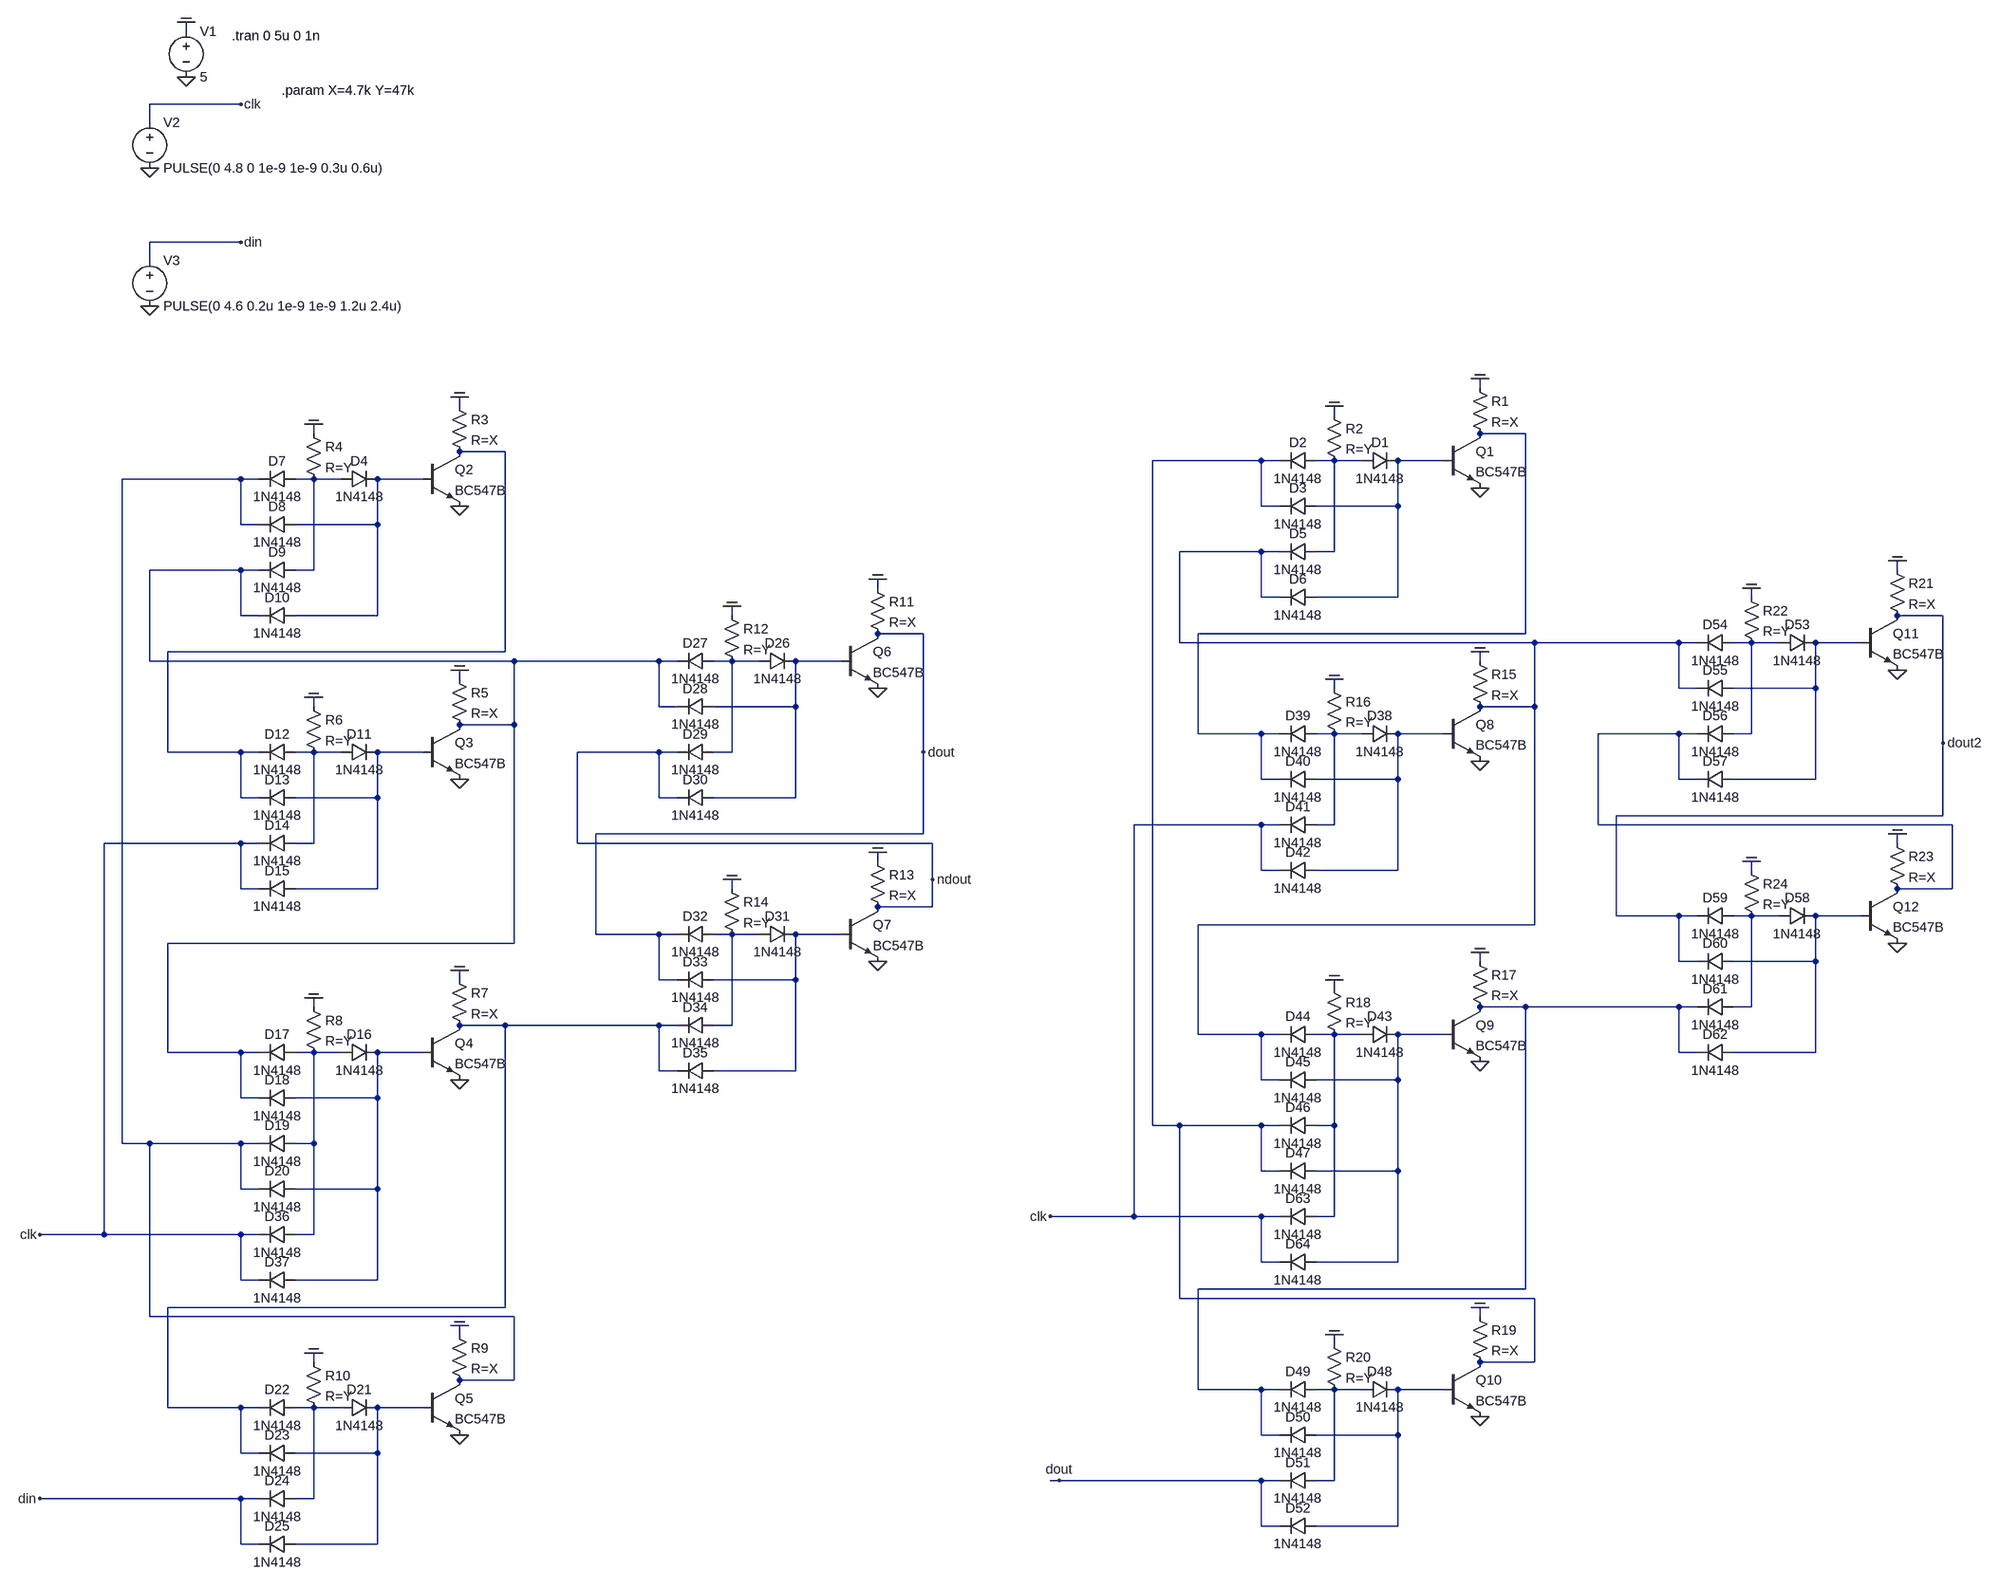
[diagram p0: schematic dtl_shiftreg.asc]
dtl_shiftreg.asc, the LTspice schematic file:
Version 4
SHEET 1 4000 3056
WIRE -16 -144 -16 -160
WIRE 80 -16 -80 -16
WIRE -80 16 -80 -16
WIRE 80 240 -80 240
WIRE -80 272 -80 240
WIRE 2816 976 2816 960
WIRE 464 1008 464 992
WIRE 2560 1024 2560 1008
WIRE 208 1056 208 1040
WIRE 2896 1056 2816 1056
WIRE 544 1088 464 1088
WIRE 2432 1104 2224 1104
WIRE 2464 1104 2432 1104
WIRE 2560 1104 2528 1104
WIRE 2608 1104 2560 1104
WIRE 2752 1104 2672 1104
WIRE 80 1136 -128 1136
WIRE 112 1136 80 1136
WIRE 208 1136 176 1136
WIRE 256 1136 208 1136
WIRE 400 1136 320 1136
WIRE 2432 1184 2432 1104
WIRE 2464 1184 2432 1184
WIRE 2672 1184 2672 1104
WIRE 2672 1184 2528 1184
WIRE 80 1216 80 1136
WIRE 112 1216 80 1216
WIRE 320 1216 320 1136
WIRE 320 1216 176 1216
WIRE 2432 1264 2272 1264
WIRE 2464 1264 2432 1264
WIRE 2560 1264 2560 1104
WIRE 2560 1264 2528 1264
WIRE 80 1296 -80 1296
WIRE 112 1296 80 1296
WIRE 208 1296 208 1136
WIRE 208 1296 176 1296
WIRE 3872 1296 3872 1280
WIRE 1520 1328 1520 1312
WIRE 2432 1344 2432 1264
WIRE 2464 1344 2432 1344
WIRE 2672 1344 2672 1184
WIRE 2672 1344 2528 1344
WIRE 3616 1344 3616 1328
WIRE 80 1376 80 1296
WIRE 112 1376 80 1376
WIRE 320 1376 320 1216
WIRE 320 1376 176 1376
WIRE 1264 1376 1264 1360
WIRE 3952 1376 3872 1376
WIRE 1600 1408 1520 1408
WIRE 2896 1408 2896 1056
WIRE 2896 1408 2304 1408
WIRE 2272 1424 2272 1264
WIRE 2912 1424 2272 1424
WIRE 3488 1424 2912 1424
WIRE 3520 1424 3488 1424
WIRE 3616 1424 3584 1424
WIRE 3664 1424 3616 1424
WIRE 3808 1424 3728 1424
WIRE 544 1440 544 1088
WIRE 544 1440 -48 1440
WIRE -80 1456 -80 1296
WIRE 560 1456 -80 1456
WIRE 1136 1456 560 1456
WIRE 1168 1456 1136 1456
WIRE 1264 1456 1232 1456
WIRE 1312 1456 1264 1456
WIRE 1456 1456 1376 1456
WIRE 2816 1456 2816 1440
WIRE 464 1488 464 1472
WIRE 2560 1504 2560 1488
WIRE 3488 1504 3488 1424
WIRE 3520 1504 3488 1504
WIRE 3728 1504 3728 1424
WIRE 3728 1504 3584 1504
WIRE 208 1536 208 1520
WIRE 1136 1536 1136 1456
WIRE 1168 1536 1136 1536
WIRE 1376 1536 1376 1456
WIRE 1376 1536 1232 1536
WIRE 2912 1536 2912 1424
WIRE 2912 1536 2816 1536
WIRE 560 1568 560 1456
WIRE 560 1568 464 1568
WIRE 2304 1584 2304 1408
WIRE 2432 1584 2304 1584
WIRE 2464 1584 2432 1584
WIRE 2560 1584 2528 1584
WIRE 2608 1584 2560 1584
WIRE 2752 1584 2672 1584
WIRE 3488 1584 3328 1584
WIRE 3520 1584 3488 1584
WIRE 3616 1584 3616 1424
WIRE 3616 1584 3584 1584
WIRE 3952 1600 3952 1376
WIRE -48 1616 -48 1440
WIRE 80 1616 -48 1616
WIRE 112 1616 80 1616
WIRE 208 1616 176 1616
WIRE 256 1616 208 1616
WIRE 400 1616 320 1616
WIRE 1136 1616 976 1616
WIRE 1168 1616 1136 1616
WIRE 1264 1616 1264 1456
WIRE 1264 1616 1232 1616
WIRE 1600 1616 1600 1408
WIRE 2432 1664 2432 1584
WIRE 2464 1664 2432 1664
WIRE 2672 1664 2672 1584
WIRE 2672 1664 2528 1664
WIRE 3488 1664 3488 1584
WIRE 3520 1664 3488 1664
WIRE 3728 1664 3728 1504
WIRE 3728 1664 3584 1664
WIRE 80 1696 80 1616
WIRE 112 1696 80 1696
WIRE 320 1696 320 1616
WIRE 320 1696 176 1696
WIRE 1136 1696 1136 1616
WIRE 1168 1696 1136 1696
WIRE 1376 1696 1376 1536
WIRE 1376 1696 1232 1696
WIRE 3952 1728 3952 1600
WIRE 3952 1728 3360 1728
WIRE 2432 1744 2192 1744
WIRE 2464 1744 2432 1744
WIRE 2560 1744 2560 1584
WIRE 2560 1744 2528 1744
WIRE 3328 1744 3328 1584
WIRE 3968 1744 3328 1744
WIRE 1600 1760 1600 1616
WIRE 1600 1760 1008 1760
WIRE 80 1776 -160 1776
WIRE 112 1776 80 1776
WIRE 208 1776 208 1616
WIRE 208 1776 176 1776
WIRE 976 1776 976 1616
WIRE 1616 1776 976 1776
WIRE 3872 1776 3872 1760
WIRE 1520 1808 1520 1792
WIRE 2432 1824 2432 1744
WIRE 2464 1824 2432 1824
WIRE 2672 1824 2672 1664
WIRE 2672 1824 2528 1824
WIRE 3616 1824 3616 1808
WIRE 1616 1840 1616 1776
WIRE 80 1856 80 1776
WIRE 112 1856 80 1856
WIRE 320 1856 320 1696
WIRE 320 1856 176 1856
WIRE 1264 1856 1264 1840
WIRE 3968 1856 3968 1744
WIRE 3968 1856 3872 1856
WIRE 1616 1888 1616 1840
WIRE 1616 1888 1520 1888
WIRE 3360 1904 3360 1728
WIRE 3488 1904 3360 1904
WIRE 3520 1904 3488 1904
WIRE 3616 1904 3584 1904
WIRE 3664 1904 3616 1904
WIRE 3808 1904 3728 1904
WIRE 2912 1920 2912 1536
WIRE 2912 1920 2304 1920
WIRE 1008 1936 1008 1760
WIRE 1136 1936 1008 1936
WIRE 1168 1936 1136 1936
WIRE 1264 1936 1232 1936
WIRE 1312 1936 1264 1936
WIRE 1456 1936 1376 1936
WIRE 560 1952 560 1568
WIRE 560 1952 -48 1952
WIRE 2816 1984 2816 1968
WIRE 3488 1984 3488 1904
WIRE 3520 1984 3488 1984
WIRE 3728 1984 3728 1904
WIRE 3728 1984 3584 1984
WIRE 464 2016 464 2000
WIRE 1136 2016 1136 1936
WIRE 1168 2016 1136 2016
WIRE 1376 2016 1376 1936
WIRE 1376 2016 1232 2016
WIRE 2560 2032 2560 2016
WIRE 208 2064 208 2048
WIRE 2896 2064 2816 2064
WIRE 3488 2064 2896 2064
WIRE 3520 2064 3488 2064
WIRE 3616 2064 3616 1904
WIRE 3616 2064 3584 2064
WIRE 544 2096 464 2096
WIRE 1136 2096 544 2096
WIRE 1168 2096 1136 2096
WIRE 1264 2096 1264 1936
WIRE 1264 2096 1232 2096
WIRE 2304 2112 2304 1920
WIRE 2432 2112 2304 2112
WIRE 2464 2112 2432 2112
WIRE 2560 2112 2528 2112
WIRE 2608 2112 2560 2112
WIRE 2752 2112 2672 2112
WIRE -48 2144 -48 1952
WIRE 80 2144 -48 2144
WIRE 112 2144 80 2144
WIRE 208 2144 176 2144
WIRE 256 2144 208 2144
WIRE 400 2144 320 2144
WIRE 3488 2144 3488 2064
WIRE 3520 2144 3488 2144
WIRE 3728 2144 3728 1984
WIRE 3728 2144 3584 2144
WIRE 1136 2176 1136 2096
WIRE 1168 2176 1136 2176
WIRE 1376 2176 1376 2016
WIRE 1376 2176 1232 2176
WIRE 2432 2192 2432 2112
WIRE 2464 2192 2432 2192
WIRE 2672 2192 2672 2112
WIRE 2672 2192 2528 2192
WIRE 80 2224 80 2144
WIRE 112 2224 80 2224
WIRE 320 2224 320 2144
WIRE 320 2224 176 2224
WIRE 2224 2272 2224 1104
WIRE 2272 2272 2224 2272
WIRE 2432 2272 2272 2272
WIRE 2464 2272 2432 2272
WIRE 2560 2272 2560 2112
WIRE 2560 2272 2528 2272
WIRE -128 2304 -128 1136
WIRE -80 2304 -128 2304
WIRE 80 2304 -80 2304
WIRE 112 2304 80 2304
WIRE 208 2304 208 2144
WIRE 208 2304 176 2304
WIRE 2432 2352 2432 2272
WIRE 2464 2352 2432 2352
WIRE 2672 2352 2672 2192
WIRE 2672 2352 2528 2352
WIRE 80 2384 80 2304
WIRE 112 2384 80 2384
WIRE 320 2384 320 2224
WIRE 320 2384 176 2384
WIRE 2192 2432 2192 1744
WIRE 2192 2432 2016 2432
WIRE 2432 2432 2192 2432
WIRE 2464 2432 2432 2432
WIRE 2560 2432 2560 2272
WIRE 2560 2432 2528 2432
WIRE -160 2464 -160 1776
WIRE -160 2464 -336 2464
WIRE 80 2464 -160 2464
WIRE 112 2464 80 2464
WIRE 208 2464 208 2304
WIRE 208 2464 176 2464
WIRE 2432 2512 2432 2432
WIRE 2464 2512 2432 2512
WIRE 2672 2512 2672 2352
WIRE 2672 2512 2528 2512
WIRE 80 2544 80 2464
WIRE 112 2544 80 2544
WIRE 320 2544 320 2384
WIRE 320 2544 176 2544
WIRE 2896 2560 2896 2064
WIRE 2896 2560 2304 2560
WIRE 2272 2576 2272 2272
WIRE 2912 2576 2272 2576
WIRE 544 2592 544 2096
WIRE 544 2592 -48 2592
WIRE -80 2608 -80 2304
WIRE 560 2608 -80 2608
WIRE 2816 2608 2816 2592
WIRE 464 2640 464 2624
WIRE 2560 2656 2560 2640
WIRE 208 2688 208 2672
WIRE 2912 2688 2912 2576
WIRE 2912 2688 2816 2688
WIRE 560 2720 560 2608
WIRE 560 2720 464 2720
WIRE 2304 2736 2304 2560
WIRE 2432 2736 2304 2736
WIRE 2464 2736 2432 2736
WIRE 2560 2736 2528 2736
WIRE 2608 2736 2560 2736
WIRE 2752 2736 2672 2736
WIRE -48 2768 -48 2592
WIRE 80 2768 -48 2768
WIRE 112 2768 80 2768
WIRE 208 2768 176 2768
WIRE 256 2768 208 2768
WIRE 400 2768 320 2768
WIRE 2432 2816 2432 2736
WIRE 2464 2816 2432 2816
WIRE 2672 2816 2672 2736
WIRE 2672 2816 2528 2816
WIRE 80 2848 80 2768
WIRE 112 2848 80 2848
WIRE 320 2848 320 2768
WIRE 320 2848 176 2848
WIRE 2032 2896 2016 2896
WIRE 2432 2896 2032 2896
WIRE 2464 2896 2432 2896
WIRE 2560 2896 2560 2736
WIRE 2560 2896 2528 2896
WIRE 80 2928 -336 2928
WIRE 112 2928 80 2928
WIRE 208 2928 208 2768
WIRE 208 2928 176 2928
WIRE 2432 2976 2432 2896
WIRE 2464 2976 2432 2976
WIRE 2672 2976 2672 2816
WIRE 2672 2976 2528 2976
WIRE 80 3008 80 2928
WIRE 112 3008 80 3008
WIRE 320 3008 320 2848
WIRE 320 3008 176 3008
FLAG -16 -64 0
FLAG -16 -160 COM
FLAG -80 96 0
FLAG 464 1184 0
FLAG 464 992 COM
FLAG 208 1040 COM
FLAG 464 1664 0
FLAG 464 1472 COM
FLAG 208 1520 COM
FLAG 464 2192 0
FLAG 464 2000 COM
FLAG 208 2048 COM
FLAG 464 2816 0
FLAG 464 2624 COM
FLAG 208 2672 COM
FLAG 1520 1504 0
FLAG 1520 1312 COM
FLAG 1264 1360 COM
FLAG 1520 1984 0
FLAG 1520 1792 COM
FLAG 1264 1840 COM
FLAG -336 2464 clk
FLAG -336 2928 din
FLAG 1600 1616 dout
FLAG 80 -16 clk
FLAG -80 352 0
FLAG 80 240 din
FLAG 1616 1840 ndout
FLAG 2816 1152 0
FLAG 2816 960 COM
FLAG 2560 1008 COM
FLAG 2816 1632 0
FLAG 2816 1440 COM
FLAG 2560 1488 COM
FLAG 2816 2160 0
FLAG 2816 1968 COM
FLAG 2560 2016 COM
FLAG 2816 2784 0
FLAG 2816 2592 COM
FLAG 2560 2640 COM
FLAG 3872 1472 0
FLAG 3872 1280 COM
FLAG 3616 1328 COM
FLAG 3872 1952 0
FLAG 3872 1760 COM
FLAG 3616 1808 COM
FLAG 2016 2432 clk
FLAG 2032 2896 dout
FLAG 3952 1600 dout2
SYMBOL voltage -16 -160 R0
WINDOW 123 0 0 Left 2
WINDOW 39 0 0 Left 2
SYMATTR InstName V1
SYMATTR Value 5
SYMBOL voltage -80 0 R0
WINDOW 123 0 0 Left 2
WINDOW 39 0 0 Left 2
SYMATTR InstName V2
SYMATTR Value PULSE(0 4.8 0 1e-9 1e-9 0.3u 0.6u)
SYMBOL diode 256 1152 R270
WINDOW 0 32 32 VTop 2
WINDOW 3 0 32 VBottom 2
SYMATTR InstName D4
SYMATTR Value 1N4148
SYMBOL npn 400 1088 R0
SYMATTR InstName Q2
SYMATTR Value BC547B
SYMBOL res 448 992 R0
SYMATTR InstName R3
SYMATTR Value R=X
SYMBOL diode 176 1120 R90
WINDOW 0 0 32 VBottom 2
WINDOW 3 32 32 VTop 2
SYMATTR InstName D7
SYMATTR Value 1N4148
SYMBOL res 192 1040 R0
SYMATTR InstName R4
SYMATTR Value R=Y
SYMBOL diode 176 1200 R90
WINDOW 0 0 32 VBottom 2
WINDOW 3 32 32 VTop 2
SYMATTR InstName D8
SYMATTR Value 1N4148
SYMBOL diode 176 1280 R90
WINDOW 0 0 32 VBottom 2
WINDOW 3 32 32 VTop 2
SYMATTR InstName D9
SYMATTR Value 1N4148
SYMBOL diode 176 1360 R90
WINDOW 0 0 32 VBottom 2
WINDOW 3 32 32 VTop 2
SYMATTR InstName D10
SYMATTR Value 1N4148
SYMBOL diode 256 1632 R270
WINDOW 0 32 32 VTop 2
WINDOW 3 0 32 VBottom 2
SYMATTR InstName D11
SYMATTR Value 1N4148
SYMBOL npn 400 1568 R0
SYMATTR InstName Q3
SYMATTR Value BC547B
SYMBOL res 448 1472 R0
SYMATTR InstName R5
SYMATTR Value R=X
SYMBOL diode 176 1600 R90
WINDOW 0 0 32 VBottom 2
WINDOW 3 32 32 VTop 2
SYMATTR InstName D12
SYMATTR Value 1N4148
SYMBOL res 192 1520 R0
SYMATTR InstName R6
SYMATTR Value R=Y
SYMBOL diode 176 1680 R90
WINDOW 0 0 32 VBottom 2
WINDOW 3 32 32 VTop 2
SYMATTR InstName D13
SYMATTR Value 1N4148
SYMBOL diode 176 1760 R90
WINDOW 0 0 32 VBottom 2
WINDOW 3 32 32 VTop 2
SYMATTR InstName D14
SYMATTR Value 1N4148
SYMBOL diode 176 1840 R90
WINDOW 0 0 32 VBottom 2
WINDOW 3 32 32 VTop 2
SYMATTR InstName D15
SYMATTR Value 1N4148
SYMBOL diode 256 2160 R270
WINDOW 0 32 32 VTop 2
WINDOW 3 0 32 VBottom 2
SYMATTR InstName D16
SYMATTR Value 1N4148
SYMBOL npn 400 2096 R0
SYMATTR InstName Q4
SYMATTR Value BC547B
SYMBOL res 448 2000 R0
SYMATTR InstName R7
SYMATTR Value R=X
SYMBOL diode 176 2128 R90
WINDOW 0 0 32 VBottom 2
WINDOW 3 32 32 VTop 2
SYMATTR InstName D17
SYMATTR Value 1N4148
SYMBOL res 192 2048 R0
SYMATTR InstName R8
SYMATTR Value R=Y
SYMBOL diode 176 2208 R90
WINDOW 0 0 32 VBottom 2
WINDOW 3 32 32 VTop 2
SYMATTR InstName D18
SYMATTR Value 1N4148
SYMBOL diode 176 2288 R90
WINDOW 0 0 32 VBottom 2
WINDOW 3 32 32 VTop 2
SYMATTR InstName D19
SYMATTR Value 1N4148
SYMBOL diode 176 2368 R90
WINDOW 0 0 32 VBottom 2
WINDOW 3 32 32 VTop 2
SYMATTR InstName D20
SYMATTR Value 1N4148
SYMBOL diode 256 2784 R270
WINDOW 0 32 32 VTop 2
WINDOW 3 0 32 VBottom 2
SYMATTR InstName D21
SYMATTR Value 1N4148
SYMBOL npn 400 2720 R0
SYMATTR InstName Q5
SYMATTR Value BC547B
SYMBOL res 448 2624 R0
SYMATTR InstName R9
SYMATTR Value R=X
SYMBOL diode 176 2752 R90
WINDOW 0 0 32 VBottom 2
WINDOW 3 32 32 VTop 2
SYMATTR InstName D22
SYMATTR Value 1N4148
SYMBOL res 192 2672 R0
SYMATTR InstName R10
SYMATTR Value R=Y
SYMBOL diode 176 2832 R90
WINDOW 0 0 32 VBottom 2
WINDOW 3 32 32 VTop 2
SYMATTR InstName D23
SYMATTR Value 1N4148
SYMBOL diode 176 2912 R90
WINDOW 0 0 32 VBottom 2
WINDOW 3 32 32 VTop 2
SYMATTR InstName D24
SYMATTR Value 1N4148
SYMBOL diode 176 2992 R90
WINDOW 0 0 32 VBottom 2
WINDOW 3 32 32 VTop 2
SYMATTR InstName D25
SYMATTR Value 1N4148
SYMBOL diode 1312 1472 R270
WINDOW 0 32 32 VTop 2
WINDOW 3 0 32 VBottom 2
SYMATTR InstName D26
SYMATTR Value 1N4148
SYMBOL npn 1456 1408 R0
SYMATTR InstName Q6
SYMATTR Value BC547B
SYMBOL res 1504 1312 R0
SYMATTR InstName R11
SYMATTR Value R=X
SYMBOL diode 1232 1440 R90
WINDOW 0 0 32 VBottom 2
WINDOW 3 32 32 VTop 2
SYMATTR InstName D27
SYMATTR Value 1N4148
SYMBOL res 1248 1360 R0
SYMATTR InstName R12
SYMATTR Value R=Y
SYMBOL diode 1232 1520 R90
WINDOW 0 0 32 VBottom 2
WINDOW 3 32 32 VTop 2
SYMATTR InstName D28
SYMATTR Value 1N4148
SYMBOL diode 1232 1600 R90
WINDOW 0 0 32 VBottom 2
WINDOW 3 32 32 VTop 2
SYMATTR InstName D29
SYMATTR Value 1N4148
SYMBOL diode 1232 1680 R90
WINDOW 0 0 32 VBottom 2
WINDOW 3 32 32 VTop 2
SYMATTR InstName D30
SYMATTR Value 1N4148
SYMBOL diode 1312 1952 R270
WINDOW 0 32 32 VTop 2
WINDOW 3 0 32 VBottom 2
SYMATTR InstName D31
SYMATTR Value 1N4148
SYMBOL npn 1456 1888 R0
SYMATTR InstName Q7
SYMATTR Value BC547B
SYMBOL res 1504 1792 R0
SYMATTR InstName R13
SYMATTR Value R=X
SYMBOL diode 1232 1920 R90
WINDOW 0 0 32 VBottom 2
WINDOW 3 32 32 VTop 2
SYMATTR InstName D32
SYMATTR Value 1N4148
SYMBOL res 1248 1840 R0
SYMATTR InstName R14
SYMATTR Value R=Y
SYMBOL diode 1232 2000 R90
WINDOW 0 0 32 VBottom 2
WINDOW 3 32 32 VTop 2
SYMATTR InstName D33
SYMATTR Value 1N4148
SYMBOL diode 1232 2080 R90
WINDOW 0 0 32 VBottom 2
WINDOW 3 32 32 VTop 2
SYMATTR InstName D34
SYMATTR Value 1N4148
SYMBOL diode 1232 2160 R90
WINDOW 0 0 32 VBottom 2
WINDOW 3 32 32 VTop 2
SYMATTR InstName D35
SYMATTR Value 1N4148
SYMBOL diode 176 2448 R90
WINDOW 0 0 32 VBottom 2
WINDOW 3 32 32 VTop 2
SYMATTR InstName D36
SYMATTR Value 1N4148
SYMBOL diode 176 2528 R90
WINDOW 0 0 32 VBottom 2
WINDOW 3 32 32 VTop 2
SYMATTR InstName D37
SYMATTR Value 1N4148
SYMBOL voltage -80 256 R0
WINDOW 123 0 0 Left 2
WINDOW 39 0 0 Left 2
SYMATTR InstName V3
SYMATTR Value PULSE(0 4.6 0.2u 1e-9 1e-9 1.2u 2.4u)
SYMBOL diode 2608 1120 R270
WINDOW 0 32 32 VTop 2
WINDOW 3 0 32 VBottom 2
SYMATTR InstName D1
SYMATTR Value 1N4148
SYMBOL npn 2752 1056 R0
SYMATTR InstName Q1
SYMATTR Value BC547B
SYMBOL res 2800 960 R0
SYMATTR InstName R1
SYMATTR Value R=X
SYMBOL diode 2528 1088 R90
WINDOW 0 0 32 VBottom 2
WINDOW 3 32 32 VTop 2
SYMATTR InstName D2
SYMATTR Value 1N4148
SYMBOL res 2544 1008 R0
SYMATTR InstName R2
SYMATTR Value R=Y
SYMBOL diode 2528 1168 R90
WINDOW 0 0 32 VBottom 2
WINDOW 3 32 32 VTop 2
SYMATTR InstName D3
SYMATTR Value 1N4148
SYMBOL diode 2528 1248 R90
WINDOW 0 0 32 VBottom 2
WINDOW 3 32 32 VTop 2
SYMATTR InstName D5
SYMATTR Value 1N4148
SYMBOL diode 2528 1328 R90
WINDOW 0 0 32 VBottom 2
WINDOW 3 32 32 VTop 2
SYMATTR InstName D6
SYMATTR Value 1N4148
SYMBOL diode 2608 1600 R270
WINDOW 0 32 32 VTop 2
WINDOW 3 0 32 VBottom 2
SYMATTR InstName D38
SYMATTR Value 1N4148
SYMBOL npn 2752 1536 R0
SYMATTR InstName Q8
SYMATTR Value BC547B
SYMBOL res 2800 1440 R0
SYMATTR InstName R15
SYMATTR Value R=X
SYMBOL diode 2528 1568 R90
WINDOW 0 0 32 VBottom 2
WINDOW 3 32 32 VTop 2
SYMATTR InstName D39
SYMATTR Value 1N4148
SYMBOL res 2544 1488 R0
SYMATTR InstName R16
SYMATTR Value R=Y
SYMBOL diode 2528 1648 R90
WINDOW 0 0 32 VBottom 2
WINDOW 3 32 32 VTop 2
SYMATTR InstName D40
SYMATTR Value 1N4148
SYMBOL diode 2528 1728 R90
WINDOW 0 0 32 VBottom 2
WINDOW 3 32 32 VTop 2
SYMATTR InstName D41
SYMATTR Value 1N4148
SYMBOL diode 2528 1808 R90
WINDOW 0 0 32 VBottom 2
WINDOW 3 32 32 VTop 2
SYMATTR InstName D42
SYMATTR Value 1N4148
SYMBOL diode 2608 2128 R270
WINDOW 0 32 32 VTop 2
WINDOW 3 0 32 VBottom 2
SYMATTR InstName D43
SYMATTR Value 1N4148
SYMBOL npn 2752 2064 R0
SYMATTR InstName Q9
SYMATTR Value BC547B
SYMBOL res 2800 1968 R0
SYMATTR InstName R17
SYMATTR Value R=X
SYMBOL diode 2528 2096 R90
WINDOW 0 0 32 VBottom 2
WINDOW 3 32 32 VTop 2
SYMATTR InstName D44
SYMATTR Value 1N4148
SYMBOL res 2544 2016 R0
SYMATTR InstName R18
SYMATTR Value R=Y
SYMBOL diode 2528 2176 R90
WINDOW 0 0 32 VBottom 2
WINDOW 3 32 32 VTop 2
SYMATTR InstName D45
SYMATTR Value 1N4148
SYMBOL diode 2528 2256 R90
WINDOW 0 0 32 VBottom 2
WINDOW 3 32 32 VTop 2
SYMATTR InstName D46
SYMATTR Value 1N4148
SYMBOL diode 2528 2336 R90
WINDOW 0 0 32 VBottom 2
WINDOW 3 32 32 VTop 2
SYMATTR InstName D47
SYMATTR Value 1N4148
SYMBOL diode 2608 2752 R270
WINDOW 0 32 32 VTop 2
WINDOW 3 0 32 VBottom 2
SYMATTR InstName D48
SYMATTR Value 1N4148
SYMBOL npn 2752 2688 R0
SYMATTR InstName Q10
SYMATTR Value BC547B
SYMBOL res 2800 2592 R0
SYMATTR InstName R19
SYMATTR Value R=X
SYMBOL diode 2528 2720 R90
WINDOW 0 0 32 VBottom 2
WINDOW 3 32 32 VTop 2
SYMATTR InstName D49
SYMATTR Value 1N4148
SYMBOL res 2544 2640 R0
SYMATTR InstName R20
SYMATTR Value R=Y
SYMBOL diode 2528 2800 R90
WINDOW 0 0 32 VBottom 2
WINDOW 3 32 32 VTop 2
SYMATTR InstName D50
SYMATTR Value 1N4148
SYMBOL diode 2528 2880 R90
WINDOW 0 0 32 VBottom 2
WINDOW 3 32 32 VTop 2
SYMATTR InstName D51
SYMATTR Value 1N4148
SYMBOL diode 2528 2960 R90
WINDOW 0 0 32 VBottom 2
WINDOW 3 32 32 VTop 2
SYMATTR InstName D52
SYMATTR Value 1N4148
SYMBOL diode 3664 1440 R270
WINDOW 0 32 32 VTop 2
WINDOW 3 0 32 VBottom 2
SYMATTR InstName D53
SYMATTR Value 1N4148
SYMBOL npn 3808 1376 R0
SYMATTR InstName Q11
SYMATTR Value BC547B
SYMBOL res 3856 1280 R0
SYMATTR InstName R21
SYMATTR Value R=X
SYMBOL diode 3584 1408 R90
WINDOW 0 0 32 VBottom 2
WINDOW 3 32 32 VTop 2
SYMATTR InstName D54
SYMATTR Value 1N4148
SYMBOL res 3600 1328 R0
SYMATTR InstName R22
SYMATTR Value R=Y
SYMBOL diode 3584 1488 R90
WINDOW 0 0 32 VBottom 2
WINDOW 3 32 32 VTop 2
SYMATTR InstName D55
SYMATTR Value 1N4148
SYMBOL diode 3584 1568 R90
WINDOW 0 0 32 VBottom 2
WINDOW 3 32 32 VTop 2
SYMATTR InstName D56
SYMATTR Value 1N4148
SYMBOL diode 3584 1648 R90
WINDOW 0 0 32 VBottom 2
WINDOW 3 32 32 VTop 2
SYMATTR InstName D57
SYMATTR Value 1N4148
SYMBOL diode 3664 1920 R270
WINDOW 0 32 32 VTop 2
WINDOW 3 0 32 VBottom 2
SYMATTR InstName D58
SYMATTR Value 1N4148
SYMBOL npn 3808 1856 R0
SYMATTR InstName Q12
SYMATTR Value BC547B
SYMBOL res 3856 1760 R0
SYMATTR InstName R23
SYMATTR Value R=X
SYMBOL diode 3584 1888 R90
WINDOW 0 0 32 VBottom 2
WINDOW 3 32 32 VTop 2
SYMATTR InstName D59
SYMATTR Value 1N4148
SYMBOL res 3600 1808 R0
SYMATTR InstName R24
SYMATTR Value R=Y
SYMBOL diode 3584 1968 R90
WINDOW 0 0 32 VBottom 2
WINDOW 3 32 32 VTop 2
SYMATTR InstName D60
SYMATTR Value 1N4148
SYMBOL diode 3584 2048 R90
WINDOW 0 0 32 VBottom 2
WINDOW 3 32 32 VTop 2
SYMATTR InstName D61
SYMATTR Value 1N4148
SYMBOL diode 3584 2128 R90
WINDOW 0 0 32 VBottom 2
WINDOW 3 32 32 VTop 2
SYMATTR InstName D62
SYMATTR Value 1N4148
SYMBOL diode 2528 2416 R90
WINDOW 0 0 32 VBottom 2
WINDOW 3 32 32 VTop 2
SYMATTR InstName D63
SYMATTR Value 1N4148
SYMBOL diode 2528 2496 R90
WINDOW 0 0 32 VBottom 2
WINDOW 3 32 32 VTop 2
SYMATTR InstName D64
SYMATTR Value 1N4148
TEXT 64 -136 Left 2 !.tran 0 5u 0 1n
TEXT 152 -40 Left 2 !.param X=4.7k Y=47k

The netlist it stands for:
* dtl_shiftreg.asc
V1 COM 0 5
V2 clk 0 PULSE(0 4.8 0 1e-9 1e-9 0.3u 0.6u)
D4 N007 N008 1N4148
Q2 N002 N008 0 0 BC547B
R3 COM N002 R=X
D7 N007 N006 1N4148
R4 COM N007 R=Y
D8 N008 N006 1N4148
D9 N007 N010 1N4148
D10 N008 N010 1N4148
D11 N018 N019 1N4148
Q3 N010 N019 0 0 BC547B
R5 COM N010 R=X
D12 N018 N002 1N4148
R6 COM N018 R=Y
D13 N019 N002 1N4148
D14 N018 clk 1N4148
D15 N019 clk 1N4148
D16 N028 N029 1N4148
Q4 N025 N029 0 0 BC547B
R7 COM N025 R=X
D17 N028 N010 1N4148
R8 COM N028 R=Y
D18 N029 N010 1N4148
D19 N028 N006 1N4148
D20 N029 N006 1N4148
D21 N032 N033 1N4148
Q5 N006 N033 0 0 BC547B
R9 COM N006 R=X
D22 N032 N025 1N4148
R10 COM N032 R=Y
D23 N033 N025 1N4148
D24 N032 din 1N4148
D25 N033 din 1N4148
D26 N013 N014 1N4148
Q6 dout N014 0 0 BC547B
R11 COM dout R=X
D27 N013 N010 1N4148
R12 COM N013 R=Y
D28 N014 N010 1N4148
D29 N013 ndout 1N4148
D30 N014 ndout 1N4148
D31 N022 N023 1N4148
Q7 ndout N023 0 0 BC547B
R13 COM ndout R=X
D32 N022 dout 1N4148
R14 COM N022 R=Y
D33 N023 dout 1N4148
D34 N022 N025 1N4148
D35 N023 N025 1N4148
D36 N028 clk 1N4148
D37 N029 clk 1N4148
V3 din 0 PULSE(0 4.6 0.2u 1e-9 1e-9 1.2u 2.4u)
D1 N004 N005 1N4148
Q1 N001 N005 0 0 BC547B
R1 COM N001 R=X
D2 N004 N003 1N4148
R2 COM N004 R=Y
D3 N005 N003 1N4148
D5 N004 N009 1N4148
D6 N005 N009 1N4148
D38 N015 N016 1N4148
Q8 N009 N016 0 0 BC547B
R15 COM N009 R=X
D39 N015 N001 1N4148
R16 COM N015 R=Y
D40 N016 N001 1N4148
D41 N015 clk 1N4148
D42 N016 clk 1N4148
D43 N026 N027 1N4148
Q9 N024 N027 0 0 BC547B
R17 COM N024 R=X
D44 N026 N009 1N4148
R18 COM N026 R=Y
D45 N027 N009 1N4148
D46 N026 N003 1N4148
D47 N027 N003 1N4148
D48 N030 N031 1N4148
Q10 N003 N031 0 0 BC547B
R19 COM N003 R=X
D49 N030 N024 1N4148
R20 COM N030 R=Y
D50 N031 N024 1N4148
D51 N030 dout 1N4148
D52 N031 dout 1N4148
D53 N011 N012 1N4148
Q11 dout2 N012 0 0 BC547B
R21 COM dout2 R=X
D54 N011 N009 1N4148
R22 COM N011 R=Y
D55 N012 N009 1N4148
D56 N011 N017 1N4148
D57 N012 N017 1N4148
D58 N020 N021 1N4148
Q12 N017 N021 0 0 BC547B
R23 COM N017 R=X
D59 N020 dout2 1N4148
R24 COM N020 R=Y
D60 N021 dout2 1N4148
D61 N020 N024 1N4148
D62 N021 N024 1N4148
D63 N026 clk 1N4148
D64 N027 clk 1N4148
.model D D
.lib standard.dio
.model NPN NPN
.model PNP PNP
.lib standard.bjt
.tran 0 5u 0 1n
.param X=4.7k Y=47k
.backanno
.end